# EAGLE schematic ct_sensor_shield (EAGLE 7.6.0)
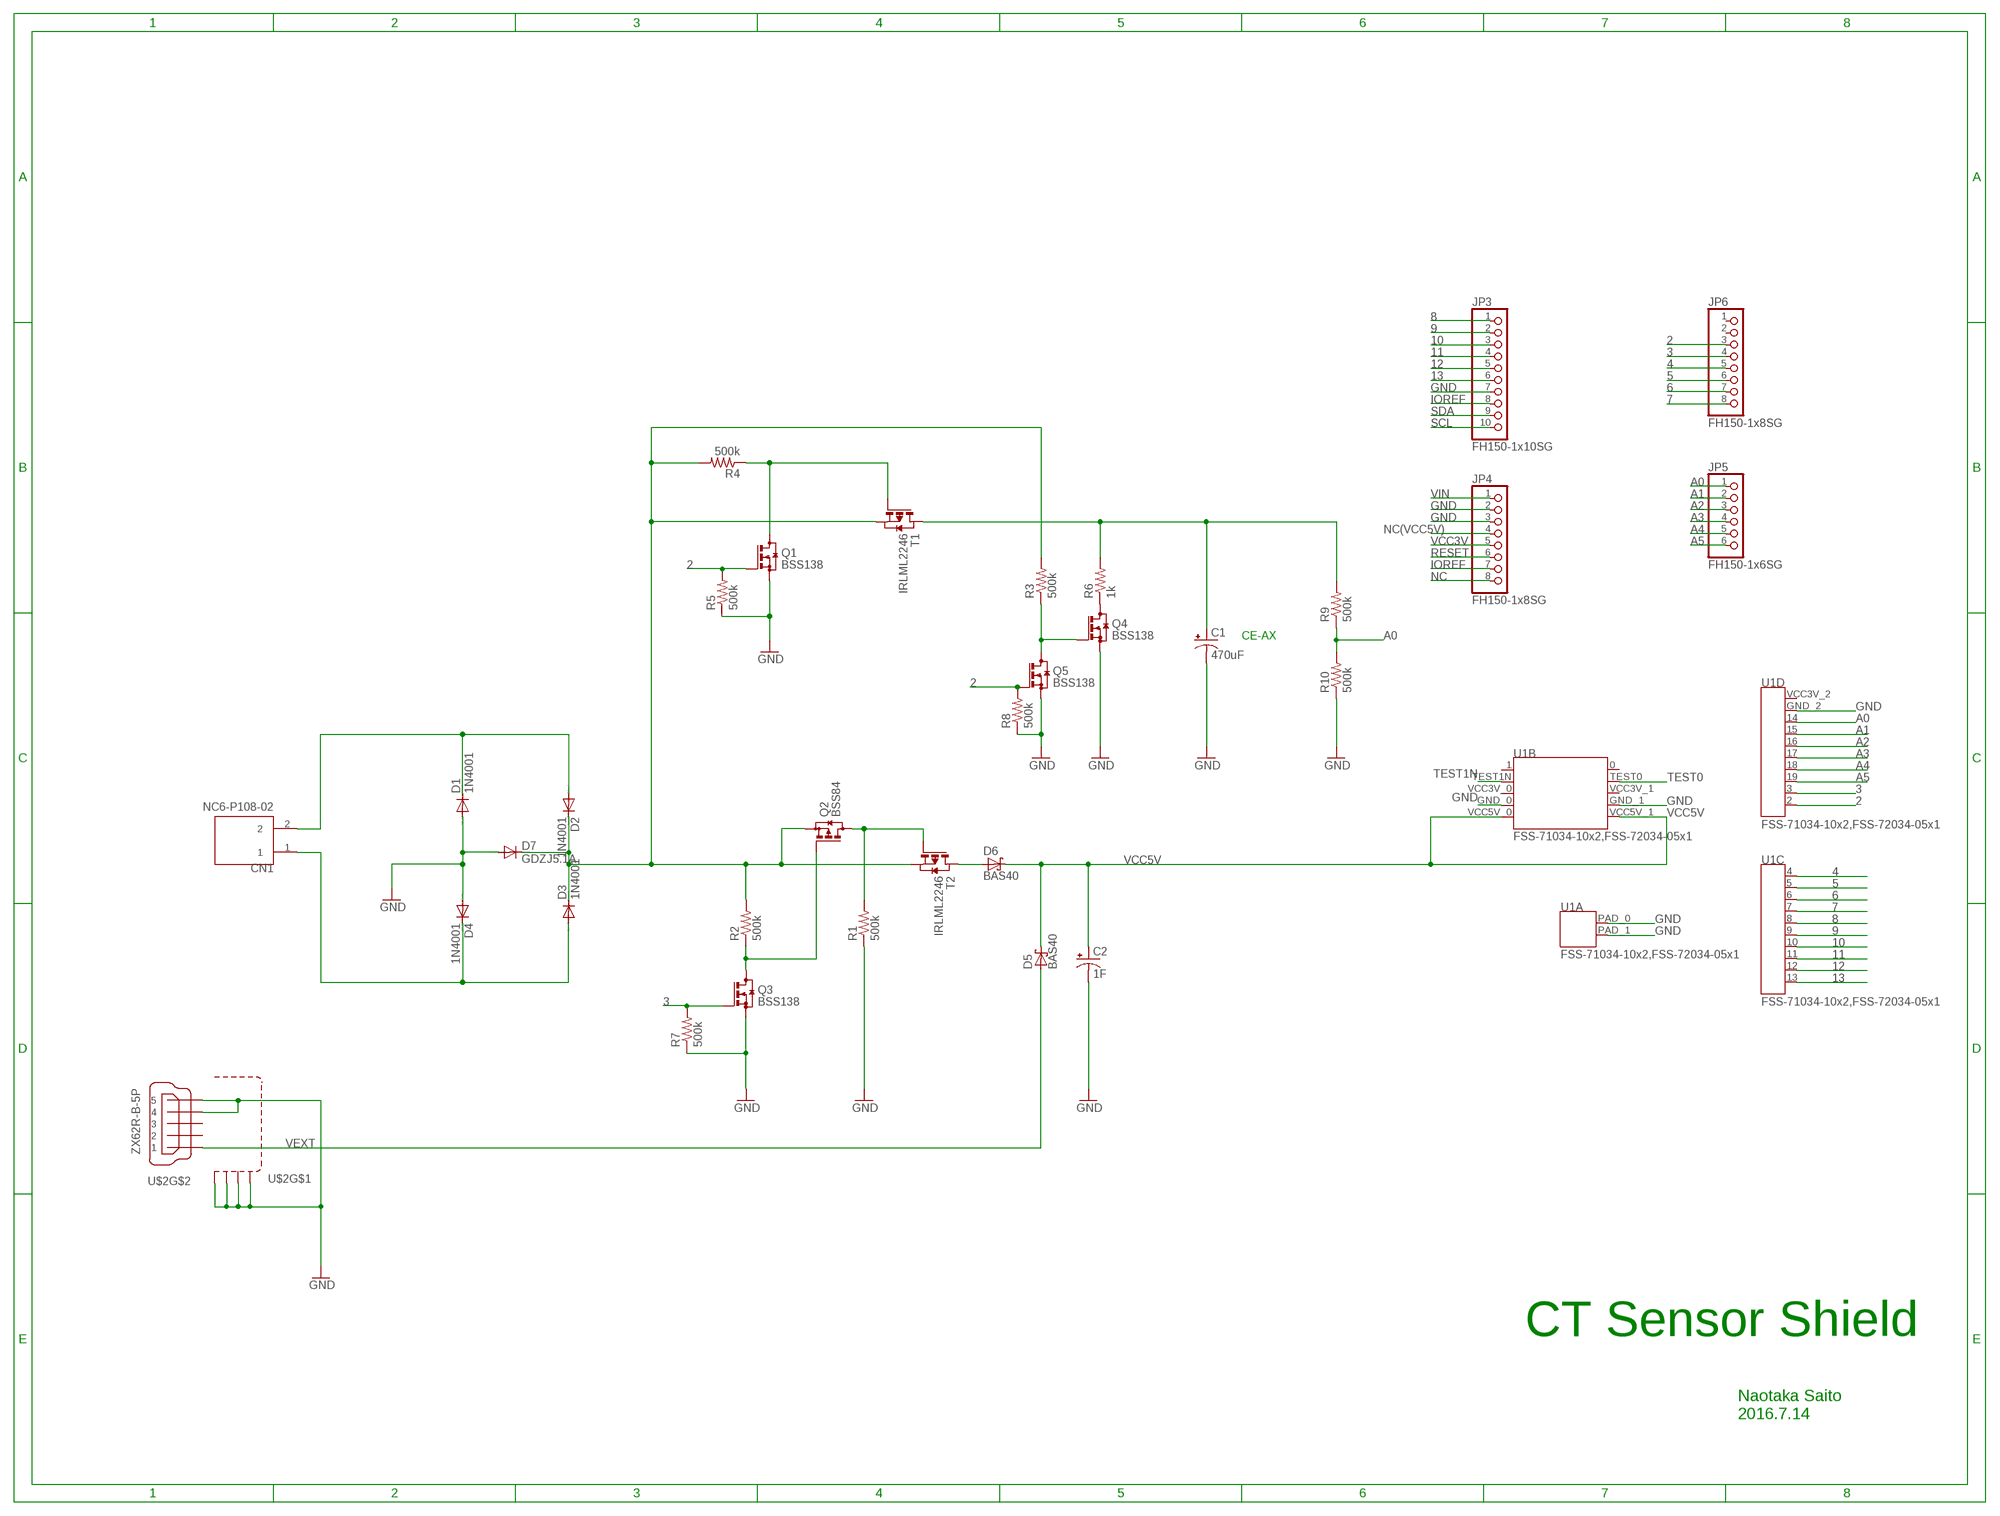
[diagram p0: schematic, sheet 1]

## Parts
C1  470uF  CPOL-USE5-10.5  [E5-10,5]
C2  1F  CPOL-USE5-20  [E5-20]
CN1  NC6-P108-02  TE-NC6-P108-02  [2PIN]
D1  1N4001  1N4004  [DO41-10]
D2  1N4001  1N4004  [DO41-10]
D3  1N4001  1N4004  [DO41-10]
D4  1N4001  1N4004  [DO41-10]
D5  BAS40  [SOT23]
D6  BAS40  [SOT23]
D7  GDZJ5.1A  BAS15  [DO34-7]
JP3  FH150-1x10SG  PINHD-1X10  [1X10]
JP4  FH150-1x8SG  PINHD-1X8  [1X08]
JP5  FH150-1x6SG  PINHD-1X6  [1X06]
JP6  FH150-1x8SG  PINHD-1X8  [1X08]
Q1  BSS138  BSS123  [SOT23]
Q2  BSS84  [SOT23]
Q3  BSS138  BSS123  [SOT23]
Q4  BSS138  BSS123  [SOT23]
Q5  BSS138  BSS123  [SOT23]
R1  500k  R-US_R0603  [R0603]
R2  500k  R-US_R0603  [R0603]
R3  500k  R-US_R0603  [R0603]
R4  500k  R-US_R0603  [R0603]
R5  500k  R-US_R0603  [R0603]
R6  1k  R-US_R0603  [R0603]
R7  500k  R-US_R0603  [R0603]
R8  500k  R-US_R0603  [R0603]
R9  500k  R-US_R0603  [R0603]
R10  500k  R-US_R0603  [R0603]
T1  IRLML2246  PMOSSOT23  [SOT-23]
T2  IRLML2246  PMOSSOT23  [SOT-23]
U1  FSS-71034-10x2,FSS-72034-05x1  LAZURITE920JLAZURITE920J  [LAZURITE920J]
U$2  ZX62R-B-5P  MICRO-USB-SHIELD-ZX62R-B-5P  [ZX62R-B-5P]

## Nets
2: JP6.3 Q1.1(G) Q5.1(G) R5.2 R8.2 U1.2
3: JP6.4 Q3.1(G) R7.2 U1.3
4: JP6.5 U1.4
5: JP6.6 U1.5
6: JP6.7 U1.6
7: JP6.8 U1.7
8: JP3.1 U1.8
9: JP3.2 U1.9
10: JP3.3 U1.10
11: JP3.4 U1.11
12: JP3.5 U1.12
13: JP3.6 U1.13
A0: JP5.1 R9.1 R10.2 U1.14
A1: JP5.2 U1.15
A2: JP5.3 U1.16
A3: JP5.4 U1.17
A4: JP5.5 U1.18
A5: JP5.6 U1.19
GND: C1.- C2.- D1.A D4.A D7.A JP3.7 JP4.2 JP4.3 Q1.2(S) Q3.2(S) Q4.2(S) Q5.2(S) R1.1 R5.1 R7.1 R8.1 R10.1 U1.GND_0(B:GND_0) U1.GND_1(B:GND_1) U1.GND_2(D:GND_2) U1.PAD_0(A:PAD_0) U1.PAD_1(A:PAD_1) U$2.4 U$2.5 U$2.M1(S1) U$2.M2(S2) U$2.M3(S3) U$2.M4(S4)
I+: CN1.2 D1.C D2.A
I-: CN1.1 D3.A D4.C
IOREF: JP3.8 JP4.7
IOUT: D2.C D3.C D7.C Q2.2(S) R2.2 R3.2 R4.2 T1.2(S) T2.2(S)
IOUT2: D6.1(A) T2.1(D)
N$1: Q2.3(D) R1.2 T2.3(G)
N$5: Q2.1(G) Q3.3(D) R2.1
N$7: Q1.3(D) R4.1 T1.3(G)
N$9: Q4.3(D) R6.1
N$10: C1.+ R6.2 R9.2 T1.1(D)
N$11: Q4.1(G) Q5.3(D) R3.1
NC: JP4.8
NC(VCC5V): JP4.4
RESET: JP4.6
SCL: JP3.10
SDA: JP3.9
TEST0: U1.TEST0(B:TEST0)
TEST1N: U1.TEST1N(B:TEST1N)
VCC3V: JP4.5
VCC5V: C2.+ D5.3(C) D6.3(C) U1.VCC5V_0(B:VCC5V_0) U1.VCC5V_1(B:VCC5V_1)
VEXT: D5.1(A) U$2.1
VIN: JP4.1
Unconnected: JP6.1 JP6.2 U1.0 U1.1 U1.VCC3V_0(B:VCC3V_0) U1.VCC3V_1(B:VCC3V_1) U1.VCC3V_2(D:VCC3V_2) U$2.2 U$2.3

## Notes on the sheet
- CE-AX
- CT Sensor Shield
- Naotaka Saito
  2016.7.14

## Library data of the parts
C1 C2 = rcl:CPOL-US: POLARIZED CAPACITOR, American symbol
CN1 = lz-shield:TE-NC6-P108-02: TE-Connectivity-AMP-Connectors NC6-P108-02 http://www.digikey.jp/product-detail/ja/te-connectivity-amp-connectors/NC6-P108-02/A98495-ND/1277926
D1-D4 = diode:1N4004: DIODE general purpose rectifier, 1 A
D5 D6 = diode:BAS40: Silicon Schottky Diodes General-purpose diode for high-speed switching
D7 = diode:BAS15: DIODE high speed
JP3 = pinhead:PINHD-1X10: PIN HEADER
JP4 JP6 = pinhead:PINHD-1X8: PIN HEADER
JP5 = pinhead:PINHD-1X6: PIN HEADER
Q1 Q3-Q5 = transistor-small-signal:BSS123: N-CHANNEL MOS FET
Q2 = transistor-small-signal:BSS84: P-CHANNEL MOS FET
R1-R10 = resistor:R-US_: RESISTOR, American symbol
T1 T2 = zetex:PMOSSOT23: MOS FET; OC_FARNELL: unknown; OC_NEWARK: unknown
U1 = lazurite:LAZURITE920J: Lazurite 920J
U$2 = con-hirose:MICRO-USB-SHIELD-: Hirose Micro USB Connector ZX62R-B-5P: Micro B, reverse (top mount) shell SMT Supplier: DigiKey H11574CT-ND Source: http://www.hirose.co.jp/cataloge_hp/e24200011.pdf

## Module LAZURITE
Ports: 

### Library data of the parts

## Net classes
1 GND: width 0.813 mm, drill 0.406 mm